# Altium schematic sheet LOGi_Bone_Top.SchDoc: LOGi-Bone Top Level
size A; Organization: Michael Jones; DocumentNumber: 1; SheetNumber: 1; SheetTotal: 7; PageSetup: Record=PageOptions|CenterHorizontal=True|CenterVertical=True|PrintScale=1.12|XCorrection=1.00|YCorrection=1.00|PrintKind=0|BorderSize=5000000|LeftOffset=0|BottomOffset=0|Orientation=2|PaperLength=1000|PaperWidth=1000|Scale=100|PaperSource=7|PrintQuality=-4|MediaType=1|DitherType=10|PaperKind=Letter|PrintScaleMode=1
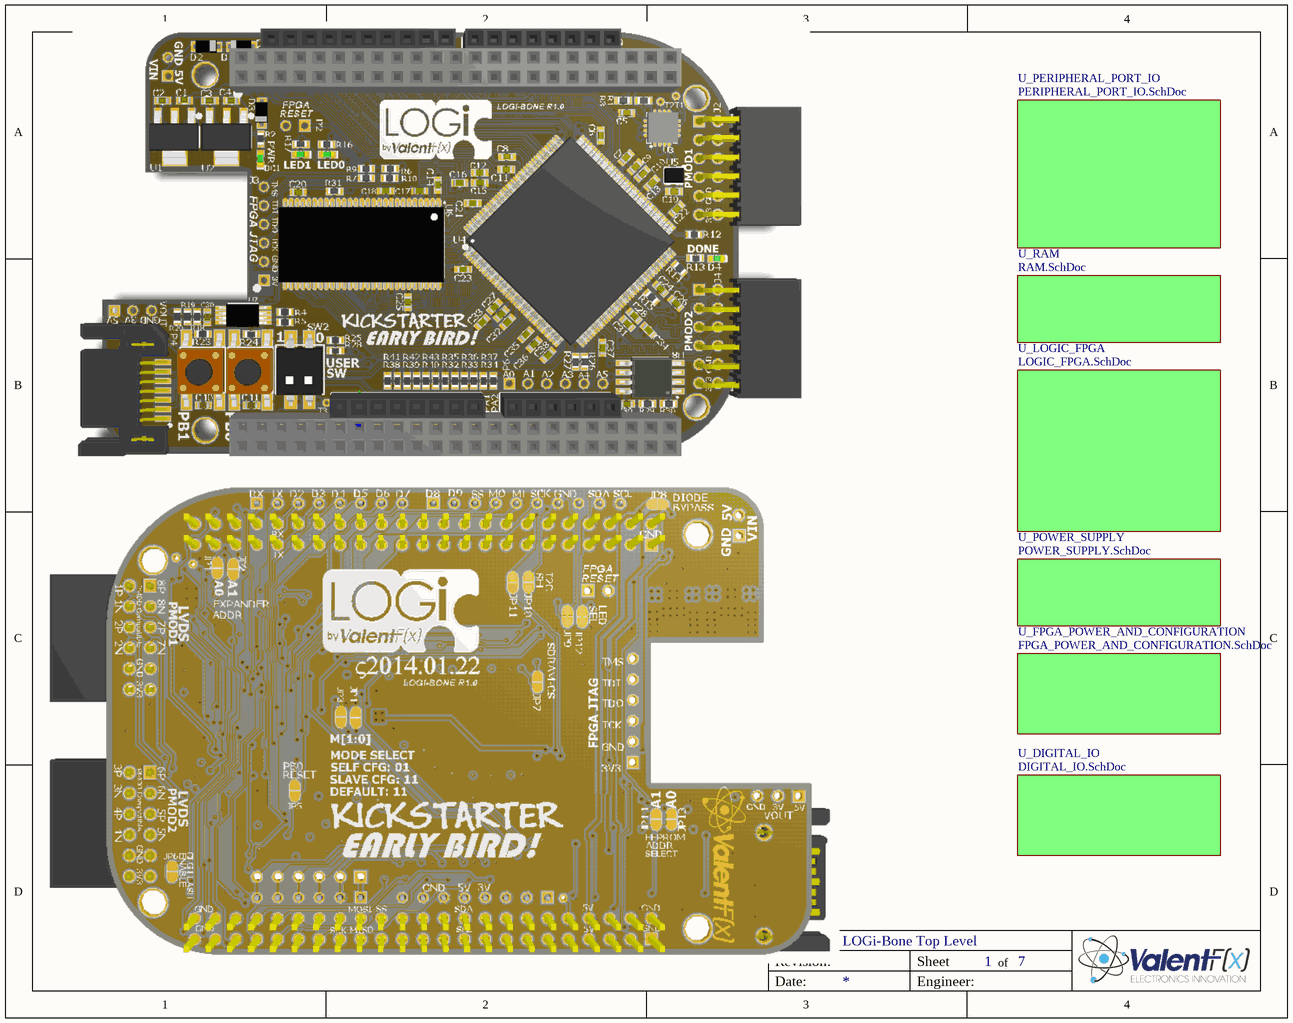
[diagram p0: LOGi_Bone_Top.SchDoc]

## Sub-sheets
U_DIGITAL_IO = DIGITAL_IO.SchDoc: no entries
U_FPGA_POWER_AND_CONFIGURATION = FPGA_POWER_AND_CONFIGURATION.SchDoc: no entries
U_LOGIC_FPGA = LOGIC_FPGA.SchDoc: no entries
U_PERIPHERAL_PORT_IO = PERIPHERAL_PORT_IO.SchDoc: no entries
U_POWER_SUPPLY = POWER_SUPPLY.SchDoc: no entries
U_RAM = RAM.SchDoc: no entries

## Notes on the sheet
- Title
- Revision:
- Sheet
- of
- Date:
- Engineer: